# EAGLE design Sub Crossover (EAGLE 5.07)
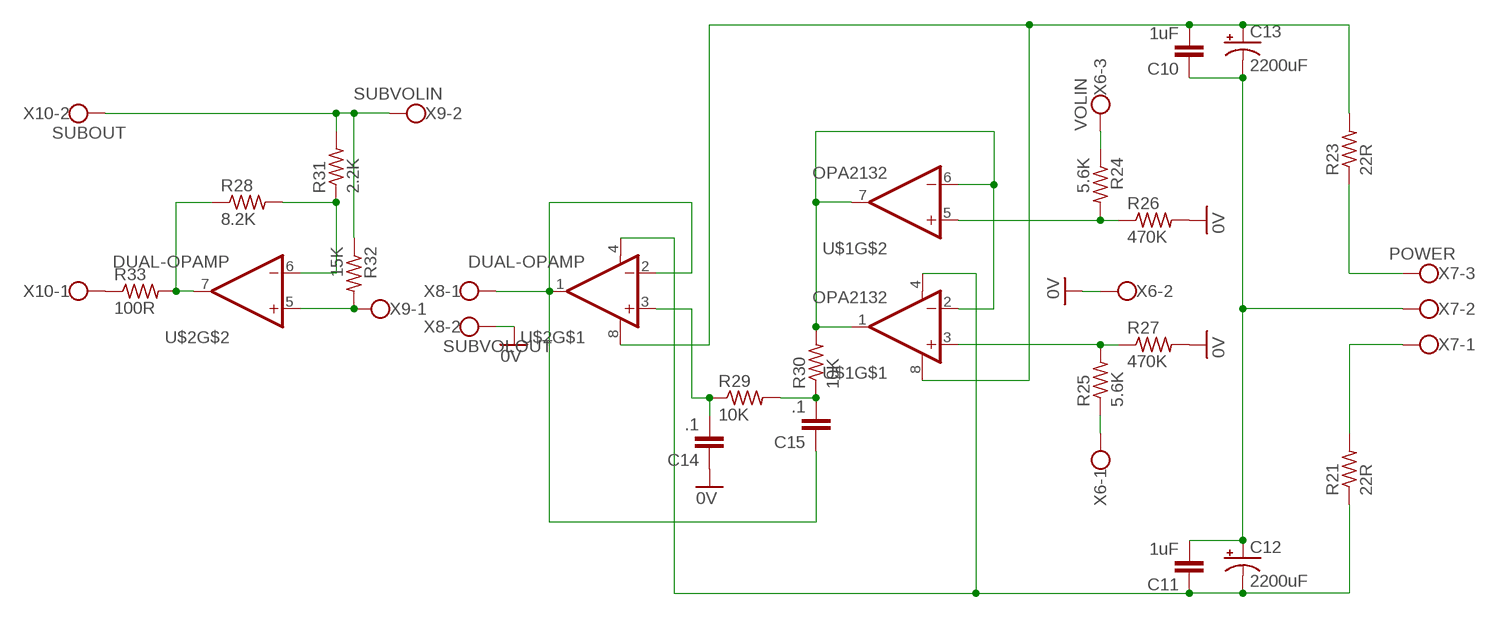
[diagram p0: schematic, sheet 1]

## Parts
C10  1uF  C-EU102-043X133  [C102-043X133]
C11  1uF  C-EU102-043X133  [C102-043X133]
C12  2200uF  CPOL-USE5-13  [E5-13]
C13  2200uF  CPOL-USE5-13  [E5-13]
C14  .1  C-EU102-043X133  [C102-043X133]
C15  .1  C-EU102-043X133  [C102-043X133]
R21  22R  R-US_0309/12  [0309/12]
R23  22R  R-US_0309/12  [0309/12]
R24  5.6K  R-US_0309/12  [0309/12]
R25  5.6K  R-US_0309/12  [0309/12]
R26  470K  R-US_0309/12  [0309/12]
R27  470K  R-US_0309/12  [0309/12]
R28  8.2K  R-US_0309/12  [0309/12]
R29  10K  R-US_0309/12  [0309/12]
R30  10K  R-US_0309/12  [0309/12]
R31  2.2K  R-US_0309/12  [0309/12]
R32  15K  R-US_0309/12  [0309/12]
R33  100R  R-US_0309/12  [0309/12]
U$1  OPA2132  DUAL-OPAMP  [DIP-8]
U$2  DUAL-OPAMP  [DIP-8]
X6  VOLIN  W237-103  [W237-103]
X7  POWER  W237-103  [W237-103]
X8  SUBVOLOUT  W237-102  [W237-102]
X9  SUBVOLIN  W237-102  [W237-102]
X10  SUBOUT  W237-102  [W237-102]

## Nets
0V: C14.1 R26.2 R27.2 X6.2 X8.2
N$29: C11.1 C12.- R21.1 U$1.4(V-) U$2.4(V-)
N$30: C10.2 C13.+ R23.2 U$1.8(V+) U$2.8(V+)
N$31: R28.2 R31.1 U$2.6(-IN)
N$32: R30.2 U$1.1(OUT) U$1.2(-IN) U$1.6(-IN) U$1.7(OUT)
N$33: R23.1 X7.3
N$34: R21.2 X7.1
N$35: R25.1 X6.1
N$36: R25.2 R27.1 U$1.3(+IN)
N$37: R24.2 R26.1 U$1.5(+IN)
N$38: R24.1 X6.3
N$39: C15.2 R29.2 R30.1
N$40: C10.1 C11.2 C12.+ C13.- X7.2
N$41: C14.2 R29.1 U$2.3(+IN)
N$42: C15.1 U$2.1(OUT) U$2.2(-IN) X8.1
N$43: R28.1 R33.2 U$2.7(OUT)
N$45: R32.2 U$2.5(+IN) X9.1
N$46: R31.2 R32.1 X9.2 X10.2
N$47: R33.1 X10.1

## Library data of the parts
C10 C11 C14 C15 = resistor:C-EU: CAPACITOR, European symbol
C12 C13 = resistor:CPOL-US: POLARIZED CAPACITOR, American symbol
R21 R23-R33 = resistor:R-US_: RESISTOR, American symbol
U$1 U$2 = opamps:DUAL-OPAMP: Generic 2-channel DIP-8 opamp
X6 X7 = con-wago-500:W237-103: WAGO SCREW CLAMP
X8-X10 = con-wago-500:W237-102: WAGO SCREW CLAMP

## Board
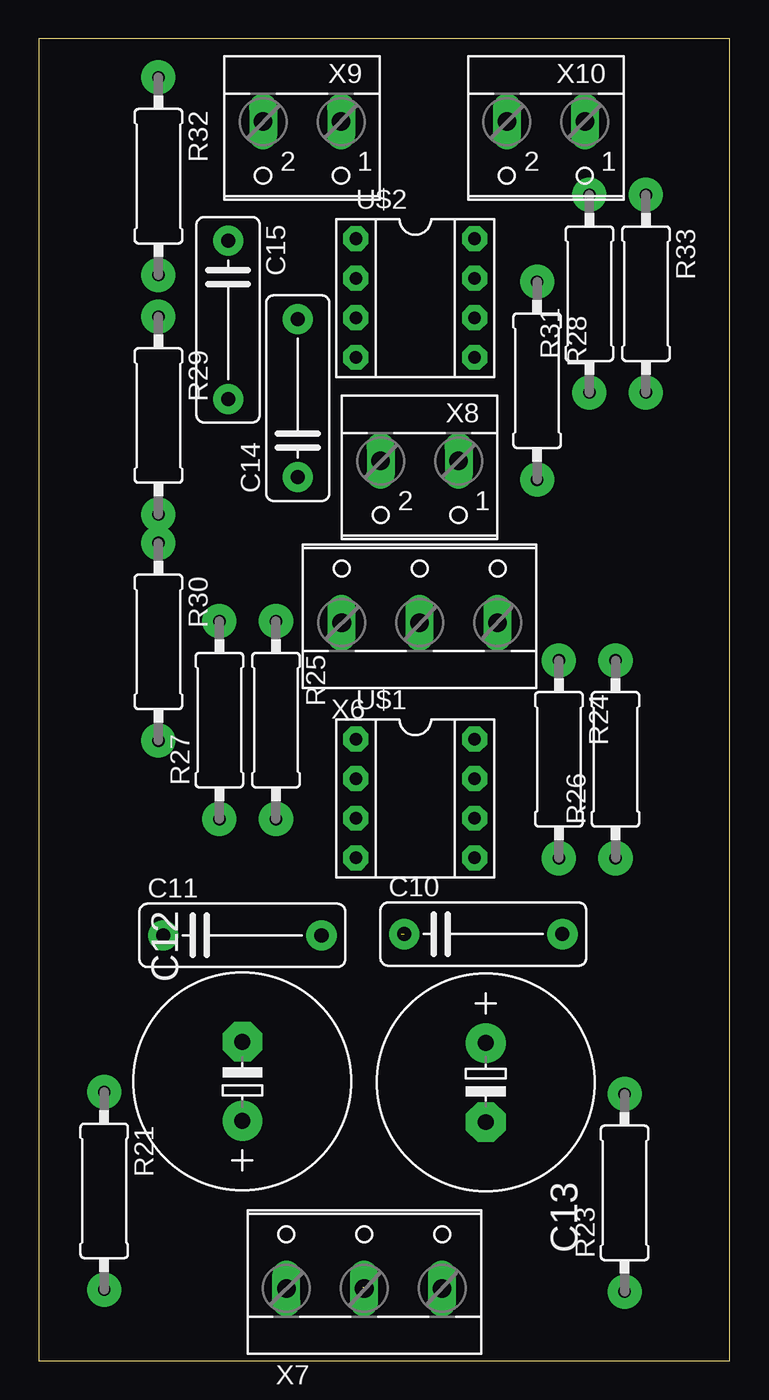
[diagram p1: board, top side]
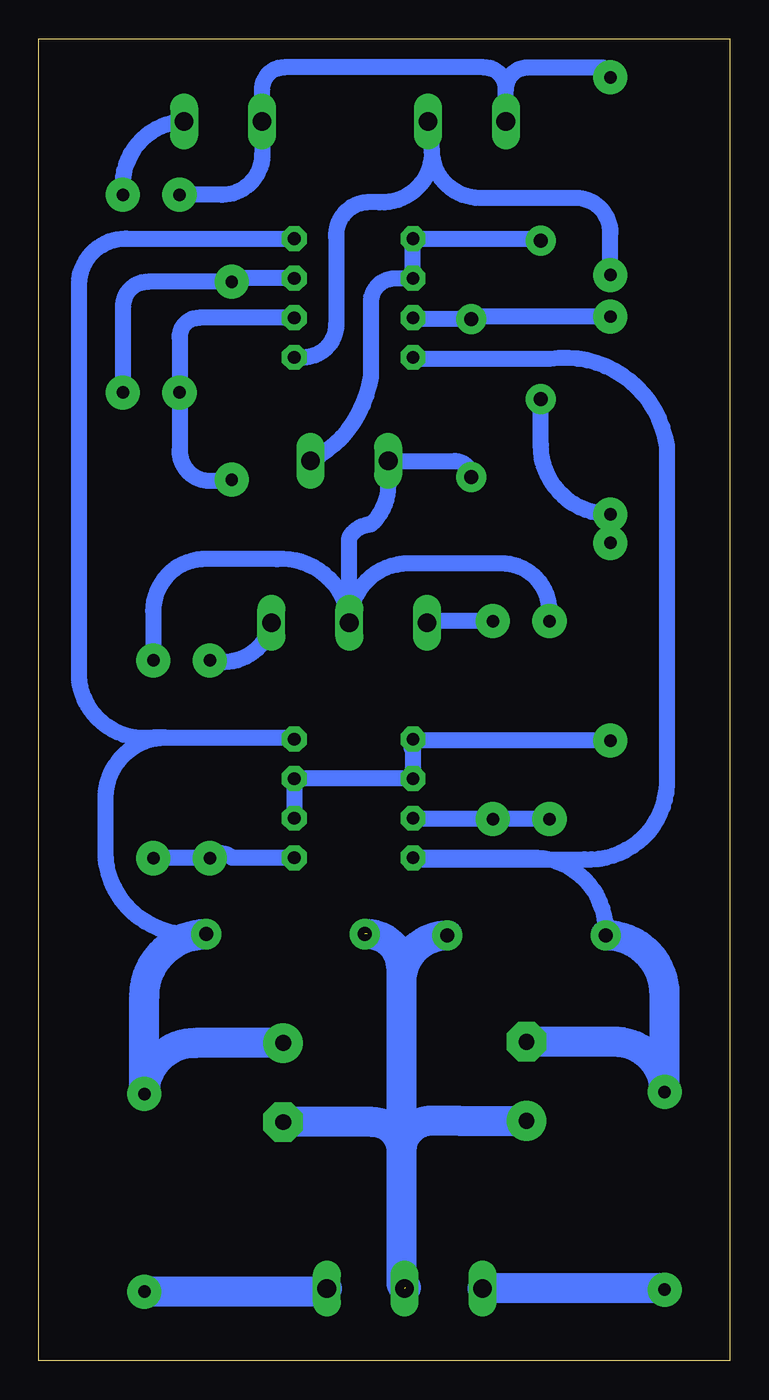
[diagram p2: board, bottom side, seen from below]

Size 44.35 x 84.86 mm. Coordinates in mm from the lower left corner, seen from the top.
Outline: 0,0 44.35,0 44.35,84.86 0,84.86 0,0
Copper layers (1*16): Top 0.035mm / dielectric 1.5mm / Bottom 0.035mm
Design rules "default": minimum track width 10mil, minimum drill 24mil, track to track 8mil, track to pad 8mil, pad to pad 8mil, via to via 8mil, smd to smd 8mil, copper to edge 40mil, drill to drill 8mil, minimum pad ring 10mil, minimum via ring 8mil, stop-mask expansion 4mil, vias tented up to drill 0mil, thermal gap 10mil

### Footprints (pad centres in the part's own frame; a part is rotated, then mirrored left to right if it is on the bottom)
C102-043X133 = drill 0.9 pad 1.93 round: 1 -5.08,0; 2 5.08,0
E5-13 = drill 1.016 pad 2.54 round: + -2.54,0 | drill 1.016 pad 2.54 octagon: - 2.54,0
0309/12 = drill 0.8 pad 2.184 round: 1 -6.35,0; 2 6.35,0
DIP-8 = drill 0.813 pad 1.6 octagon: 1 -3.81,3.81; 2 -3.81,1.27; 3 -3.81,-1.27; 4 -3.81,-3.81; 5 3.81,-3.81; 6 3.81,-1.27; 7 3.81,1.27; 8 3.81,3.81
W237-103 = drill 1.194 long: 1 -5,-1.29; 2 0,-1.29; 3 5,-1.29
W237-102 = drill 1.194 long: 1 -2.5,-1.27; 2 2.5,-1.27

### Placement (x,y rotation side)
C10  28.52,27.38 0 top
C11  13.06,27.3 0 top
C12  13.06,17.93 90 top
C13  28.68,17.86 270 top
C14  16.61,61.8 90 top
C15  12.14,66.83 270 top
R21  4.19,10.9 270 top
R23  37.59,10.77 90 top
R24  33.38,38.61 270 top
R25  15.21,41.12 270 top
R26  37.01,38.61 90 top
R27  11.58,41.12 90 top
R28  31.98,62.92 270 top
R29  7.67,60.68 270 top
R30  7.67,46.15 270 top
R31  35.33,68.5 90 top
R32  7.67,76.05 270 top
R33  38.96,68.5 270 top
U$1  24.16,36.09 0 top
U$2  24.16,68.22 0 top
X6  24.43,48.67 0 top
X7  20.88,5.92 0 top
X8  24.43,56.49 180 top
X9  16.89,78.28 180 top
X10  32.54,78.28 180 top

### Tracks (layer width: path | path; a pad name or v marks a point on that pad's centre or on a via)
0V
  Bottom 1.016: R27.2 11.58,48.11 arc-90 14.66,51.18 20.63,51.18 arc-90 X6.2 | X6.2 arc-90 29.08,51.46 33.93,51.46 arc-90 37.01,47.83 R26.2 | X6.2 24.44,52.86 arc57 23.04,53.7 arc-48 21.92,56.21 21.92,57.75 arc-90 X8.2 17.65,57.76 arc90 C14.1
N$29
  Bottom 1.016: C11.1 arc-90 12.39,32.28 U$1.4 arc-90 20.24,32.18 9.35,32.18 arc-90 4.04,36.93 4.04,58.72 arc-90 11.58,64.31 19.96,64.31 arc90 U$2.4
  Bottom 1.93: C12.- 7.42,20.47 arc90 R21.1 4.19,23.52 arc-90 C11.1
N$30
  Bottom 1.016: U$1.8 arc-90 28.07,40.01 36.17,40.01 | 36.17,40.01 arc-90 40.08,36.09 40.08,32.74 arc-90 34.72,27.38 C10.2 | 36.17,40.01 37.01,40.01 arc90 41.76,43.64 41.76,69.34 arc90 38.51,72.03 U$2.8
  Bottom 1.93: C13.+ 34.31,20.4 arc-90 R23.2 37.59,23.39 arc90 C10.2
N$31
  Bottom 1.016: U$2.6 34.09,66.95 arc-90 35.33,65.71 R31.1 35.33,58.44 arc-90 33.38,56.49 32.05,56.49 arc-90 R28.2
N$32
  Bottom 1.016: U$1.6 U$1.7 U$1.2 20.34,39.17 | 20.34,39.17 U$1.1 | R30.2 20.27,39.8 arc-90 20.34,39.17
N$33
  Bottom 1.93: X7.3 arc90 26.09,4.42 R23.1
N$34
  Bottom 1.93: X7.1 4.19,4.63 R21.2
N$35
  Bottom 1.016: R25.1 19.53,47.47 arc90 X6.1
N$36
  Bottom 1.016: R27.1 R25.2 20.3,34.77 arc90 U$1.3
N$37
  Bottom 1.016: U$1.5 31.95,32.28 arc-90 R24.2 R26.1
N$38
  Bottom 1.016: R24.1 arc-90 29.44,47.22 X6.3
N$39
  Bottom 1.016: R30.1 R29.2 arc90 12.14,58.8 C15.2
N$40  (2 unrouted)
  Bottom 1.93: 20.8,4.7 arc90 21.08,4.98 21.08,13.46 | 21.08,13.46 21.08,24.36 | 21.08,24.36 arc90 C11.2 | 23.27,27.38 arc90 21.08,25.2 21.08,24.36 | C12.+ 17.42,15.39 arc90 17.45,15.42 19.13,15.42 arc-90 21.08,13.46 | 21.08,13.46 arc-90 22.94,15.32 C13.-
N$41
  Bottom 1.016: R29.1 16.46,67.03 arc-90 C14.2 20.27,66.88 arc90 U$2.3
N$42
  Bottom 1.016: C15.1 arc-90 12.27,72.03 U$2.1 U$2.2 21.49,69.49 arc-90 23.04,67.94 23.04,63.19 arc54 X8.1
N$43
  Bottom 1.016: U$2.7 31.75,69.49 arc-90 R28.1 37.36,69.27 arc-90 38.96,67.67 R33.2
N$45
  Bottom 1.016: U$2.5 27.41,64.41 arc-90 25.27,66.55 25.27,72.14 arc90 23.32,74.37 22.48,74.37 arc-90 19.13,77.44 19.13,77.72 | 19.13,77.72 19.13,79.23 arc-90 X9.1 | R32.2 7.67,72.42 arc-90 9.91,74.65 16.05,74.65 arc90 19.13,77.72
N$46
  Bottom 1.016: 14.38,81.64 arc-90 15.77,83.03 28.63,83.03 arc-90 30.04,81.62 X10.2 arc90 30.02,79.54 30.02,77.44 arc90 32.61,74.85 R31.2 | 14.38,81.64 14.38,79.57 arc90 X9.2 14.39,81.62 arc90 14.38,81.64 | 14.38,81.64 arc90 12.98,83.03 8.31,83.03 arc90 R32.1
N$47
  Bottom 1.016: X10.1 35.38,79.55 arc-90 R33.1